# Altium project 3V3_5V_BuckConverter.PrjPcb
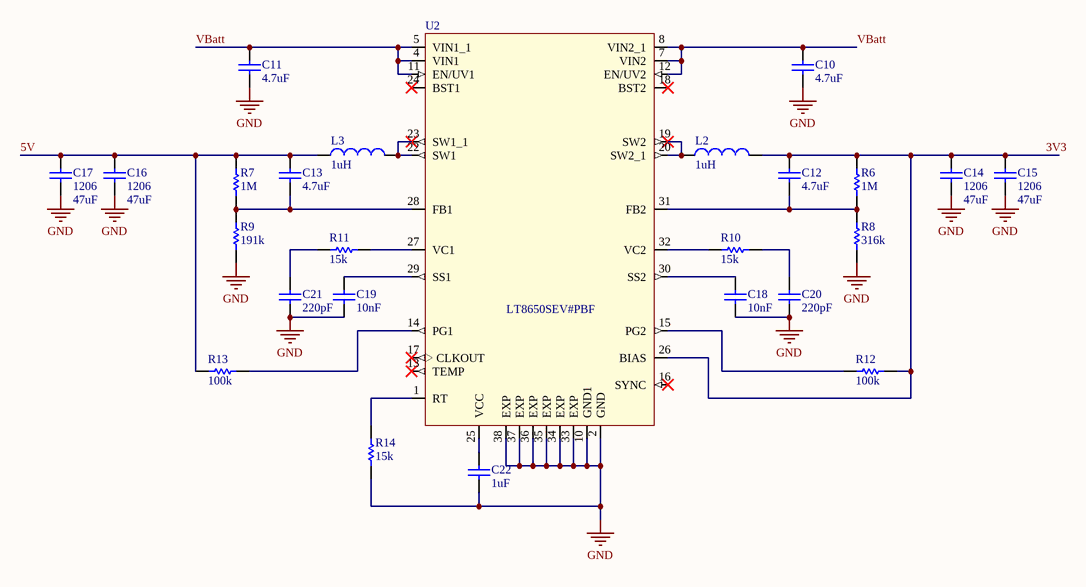
[diagram p0: 3V3_5V_BuckConverter.SchDoc]
2 sheets, 34 parts. Net scope: global (net labels, ports and power ports of the same name join across sheets).
Board file: 3V3_5V_BuckConverter.PcbDoc
Sheets:
  3V3_5V_BuckConverter.SchDoc
  Connectors.SchDoc

## Sheet 3V3_5V_BuckConverter.SchDoc
size A4

### Parts
C10  value 4.7uF  [1206]  (hidden comment: Cap)
C11  value 4.7uF  [1206]  (hidden comment: Cap)
C12  value 4.7uF  [6-0805_N]  (hidden comment: Cap)
C13  value 4.7uF  [6-0805_N]  (hidden comment: Cap)
C14  1206  value 47uF  [1206]
C15  1206  value 47uF  [1206]
C16  1206  value 47uF  [1206]
C17  1206  value 47uF  [1206]
C18  value 10nF  [6-0805_N]  (hidden comment: Cap)
C19  value 10nF  [6-0805_N]  (hidden comment: Cap)
C20  value 220pF  [6-0805_N]  (hidden comment: Cap)
C21  value 220pF  [6-0805_N]  (hidden comment: Cap)
C22  value 1uF  [6-0805_N]  (hidden comment: Cap)
L2  value 1uH  [xfl5030-102]  (hidden comment: Inductor)
L3  value 1uH  [xfl5030-102]  (hidden comment: Inductor)
R6  value 1M  [6-0805_N]  (hidden comment: Res1)
R7  value 1M  [6-0805_N]  (hidden comment: Res1)
R8  value 316k  [6-0805_N]  (hidden comment: Res1)
R9  value 191k  [6-0805_N]  (hidden comment: Res1)
R10  value 15k  [6-0805_N]  (hidden comment: Res1)
R11  value 15k  [6-0805_N]  (hidden comment: Res1)
R12  value 100k  [6-0805_N]  (hidden comment: Res1)
R13  value 100k  [6-0805_N]  (hidden comment: Res1)
R14  value 15k  [6-0805_N]  (hidden comment: Res1)
U2  LT8650SEV#PBF  [*QFN50P600X400X103-32N240X440]

### Nets
GND: C10.1 C11.1 C14.1 C15.1 C16.1 C17.1 C18.1 C19.1 C20.1 C21.1 C22.1 R8.2 R9.2 R14.2 U2.2(GND) U2.10(GND1) U2.33(EXP) U2.34(EXP) U2.35(EXP) U2.36(EXP) U2.37(EXP) U2.38(EXP)
3V3: C12.2 C14.2 C15.2 L2.2 R6.1 R12.2 U2.26(BIAS)
5V: C13.2 C16.2 C17.2 L3.1 R7.1 R13.1
VBatt: C10.2 C11.2 U2.4(VIN1) U2.5(VIN1_1) U2.7(VIN2) U2.8(VIN2_1) U2.11(EN/UV1) U2.12(EN/UV2)
NetC12_1: C12.1 R6.2 R8.1 U2.31(FB2)
NetC13_1: C13.1 R7.2 R9.1 U2.28(FB1)
NetC18_2: C18.2 U2.30(SS2)
NetC19_2: C19.2 U2.29(SS1)
NetC20_2: C20.2 R10.2
NetC21_2: C21.2 R11.1
NetC22_2: C22.2 U2.25(VCC)
NetL2_1: L2.1 U2.19(SW2) U2.20(SW2_1)
NetL3_2: L3.2 U2.22(SW1) U2.23(SW1_1)
NetR10_1: R10.1 U2.32(VC2)
NetR11_2: R11.2 U2.27(VC1)
NetR12_1: R12.1 U2.15(PG2)
NetR13_2: R13.2 U2.14(PG1)
NetR14_1: R14.1 U2.1(RT)

Not connected (* = marked no-connect by the designer): U2 13(TEMP)* 16(SYNC)* 17(CLKOUT)* 18(BST2)* 24(BST1)*

### Library data of the parts
C10-C22 = Cap: Capacitor; Published: 8-Jun-2000; LatestRevisionDate: 17-Jul-2002; LatestRevisionNote: Re-released for DXP Platform.; PackageReference: RAD-0.3; Publisher: Altium Limited; PackageDescription: Radial Cap, Thru-Hole; 2 Leads; 0.3 in Pin Spacing
L2 L3 = Inductor: Code_IEC: 1005; Published: 8-Jun-2000; LatestRevisionDate: 29-May-2009; LatestRevisionNote: IPC-7351 Footprint Added.; PackageReference: 0402-A; Publisher: Altium Limited; PackageDescription: Chip Inductor; Code_JEITA: 0402
R6-R14 = Res1: Resistor; Published: 8-Jun-2000; LatestRevisionDate: 17-Jul-2002; LatestRevisionNote: Re-released for DXP Platform.; PackageReference: AXIAL-0.3; Publisher: Altium Limited; PackageDescription: Axial Device, Thru-Hole; 2 Leads; 0.3 in Pin Spacing
U2 = LT8650SEV#PBF: Conv DC-DC 3V to 42V Synchronous Step Down Dual-Out 0.8V 4A/4A Automotive 28-Pin LQFN EP Tray; MF: Analog Devices; Digi-Key_Purchase_URL: https://www.digikey.com/product-detail/en/linear-technology-analog-devices/LT8650SEV-PBF/LT8650SEV-PBF-ND/7702365?utm_source=snapeda&utm_medium=aggregator&utm_campaign=symbol; Digi-Key_Part_Number: LT8650SEV#PBF-ND; Package: LQFN -32 Analog Devices; SnapEDA_Link: https://www.snapeda.com/parts/LT8650SEV%23PBF/Analog%20Devices/view-part/4330709/?ref=snap; MP: LT8650SEV#PBF; Value: *

## Sheet Connectors.SchDoc
size A4
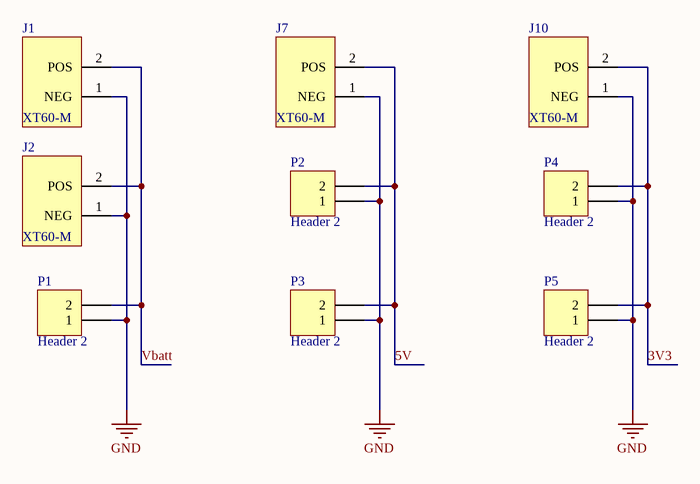
[diagram p1: Connectors.SchDoc]

### Parts
J1  XT60-M  [*AMASS_XT60-M]
J2  XT60-M  [*AMASS_XT60-M]
J7  XT60-M  [*AMASS_XT60-M]
J10  XT60-M  [*AMASS_XT60-M]
P1  Header 2  [HDR1X2]
P2  Header 2  [HDR1X2]
P3  Header 2  [HDR1X2]
P4  Header 2  [HDR1X2]
P5  Header 2  [HDR1X2]

### Nets
GND: J1.1(NEG) J2.1(NEG) J7.1(NEG) J10.1(NEG) P1.1 P2.1 P3.1 P4.1 P5.1
3V3: J10.2(POS) P4.2 P5.2
5V: J7.2(POS) P2.2 P3.2
VBatt: J1.2(POS) J2.2(POS) P1.2

### Library data of the parts
J1 J2 J7 J10 = XT60-M: Plug; DC supply; XT60; male; PIN: 2; for cable; soldered; 30A; 500V; MF: AMASS; Availability: Unavailable; Package: Package Analog Devices; MP: XT60-M; Price: None; SnapEDA_Link: https://www.snapeda.com/parts/XT60-M/AMASS/view-part/2883912/?ref=snap; Value: *
P1-P5 = Header 2: Header, 2-Pin; LatestRevisionDate: 17-Jul-2002; LatestRevisionNote: Re-released for DXP Platform.; Publisher: Altium Limited

## Nets that join several sheets
GND: 3V3_5V_BuckConverter (22 pins), Connectors (9 pins)
3V3: 3V3_5V_BuckConverter (7 pins), Connectors (J10.2 P4.2 P5.2)
5V: 3V3_5V_BuckConverter (6 pins), Connectors (J7.2 P2.2 P3.2)
VBatt: 3V3_5V_BuckConverter (8 pins), Connectors (J1.2 J2.2 P1.2)